# EAGLE design Main Board (EAGLE 6.0)
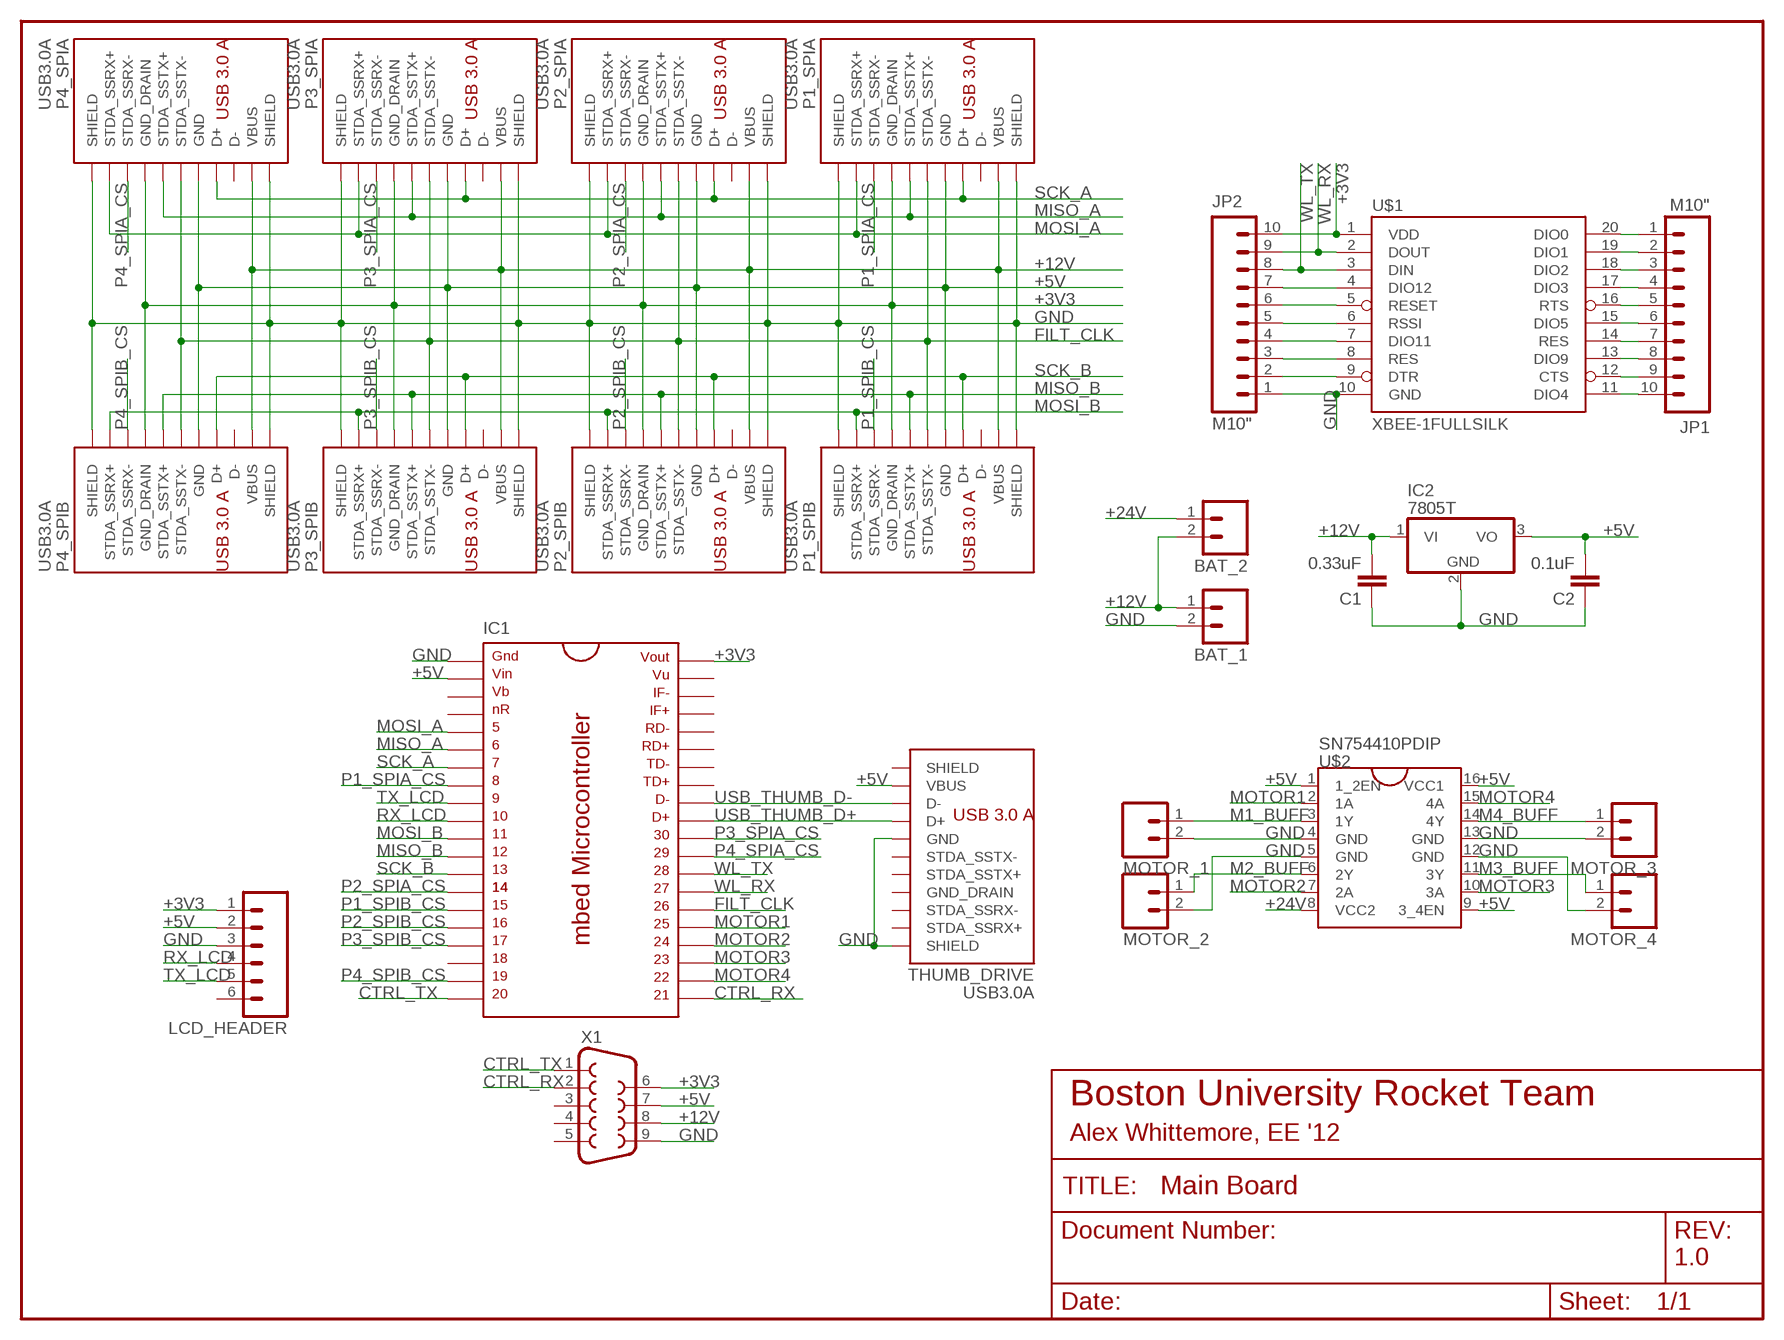
[diagram p0: schematic, sheet 1]

## Parts
BAT_1  M025MM  [SCREWTERMINAL-5MM-2]
BAT_2  M025MM  [SCREWTERMINAL-5MM-2]
C1  0.33uF  CAP0402-CAP  [0402-CAP]
C2  0.1uF  CAP0402-CAP  [0402-CAP]
IC1  MBED_MICROCONTROLLER  [DIL40_0.9]
IC2  7805T  [TO220H]
JP1  M10"  [1X10]
JP2  M10"  [1X10]
LCD_HEADER  M06LOCK  [1X06_LOCK]
MOTOR_1  M025MM  [SCREWTERMINAL-5MM-2]
MOTOR_2  M025MM  [SCREWTERMINAL-5MM-2]
MOTOR_3  M025MM  [SCREWTERMINAL-5MM-2]
MOTOR_4  M025MM  [SCREWTERMINAL-5MM-2]
P1_SPIA  USB3.0A  [AMPHENOLUSB3.0A]
P1_SPIB  USB3.0A  [AMPHENOLUSB3.0A]
P2_SPIA  USB3.0A  [AMPHENOLUSB3.0A]
P2_SPIB  USB3.0A  [AMPHENOLUSB3.0A]
P3_SPIA  USB3.0A  [AMPHENOLUSB3.0A]
P3_SPIB  USB3.0A  [AMPHENOLUSB3.0A]
P4_SPIA  USB3.0A  [AMPHENOLUSB3.0A]
P4_SPIB  USB3.0A  [AMPHENOLUSB3.0A]
THUMB_DRIVE  USB3.0A  [AMPHENOLUSB3.0A]
U$1  XBEE-1FULLSILK  [XBEE]
U$2  SN754410PDIP  [DIL16]
X1  DB9MALE  [DB9_MALE]

## Nets
+3V3: IC1.40 JP2.10 LCD_HEADER.1 P1_SPIA.7(GND_DRAIN) P1_SPIB.7(GND_DRAIN) P2_SPIA.7(GND_DRAIN) P2_SPIB.7(GND_DRAIN) P3_SPIA.7(GND_DRAIN) P3_SPIB.7(GND_DRAIN) P4_SPIA.7(GND_DRAIN) P4_SPIB.7(GND_DRAIN) U$1.1(VDD) X1.6
+5V: C2.2 IC1.2 IC2.3(VO) LCD_HEADER.2 P1_SPIA.4(GND) P1_SPIB.4(GND) P2_SPIA.4(GND) P2_SPIB.4(GND) P3_SPIA.4(GND) P3_SPIB.4(GND) P4_SPIA.4(GND) P4_SPIB.4(GND) THUMB_DRIVE.1(VBUS) U$2.1(1_2EN) U$2.9(3_4EN) U$2.16(VCC1) X1.7
+12V: BAT_1.1 BAT_2.2 C1.2 IC2.1(VI) P1_SPIA.1(VBUS) P1_SPIB.1(VBUS) P2_SPIA.1(VBUS) P2_SPIB.1(VBUS) P3_SPIA.1(VBUS) P3_SPIB.1(VBUS) P4_SPIA.1(VBUS) P4_SPIB.1(VBUS) X1.8
+24V: BAT_2.1 U$2.8(VCC2)
CTRL_RX: IC1.21 X1.2
CTRL_TX: IC1.20 X1.1
FILT_CLK: IC1.26 P1_SPIA.8(STDA_SSTX-) P1_SPIB.8(STDA_SSTX-) P2_SPIA.8(STDA_SSTX-) P2_SPIB.8(STDA_SSTX-) P3_SPIA.8(STDA_SSTX-) P3_SPIB.8(STDA_SSTX-) P4_SPIA.8(STDA_SSTX-) P4_SPIB.8(STDA_SSTX-)
GND: BAT_1.2 C1.1 C2.1 IC1.1 IC2.2(GND) JP2.1 LCD_HEADER.3 MOTOR_1.2 MOTOR_2.2 MOTOR_3.2 MOTOR_4.2 P1_SPIA.10@1(SHIELD) P1_SPIA.10@2(SHIELD) P1_SPIB.10@1(SHIELD) P1_SPIB.10@2(SHIELD) P2_SPIA.10@1(SHIELD) P2_SPIA.10@2(SHIELD) P2_SPIB.10@1(SHIELD) P2_SPIB.10@2(SHIELD) P3_SPIA.10@1(SHIELD) P3_SPIA.10@2(SHIELD) P3_SPIB.10@1(SHIELD) P3_SPIB.10@2(SHIELD) P4_SPIA.10@1(SHIELD) P4_SPIA.10@2(SHIELD) P4_SPIB.10@1(SHIELD) P4_SPIB.10@2(SHIELD) THUMB_DRIVE.4(GND) THUMB_DRIVE.10@2(SHIELD) U$1.10(GND) U$2.4(GND) U$2.5(GND) U$2.12(GND) U$2.13(GND) X1.9
M1_BUFF: MOTOR_1.1 U$2.3(1Y)
M2_BUFF: MOTOR_2.1 U$2.6(2Y)
M3_BUFF: MOTOR_4.1 U$2.11(3Y)
M4_BUFF: MOTOR_3.1 U$2.14(4Y)
MISO_A: IC1.6 P1_SPIA.9(STDA_SSTX+) P2_SPIA.9(STDA_SSTX+) P3_SPIA.9(STDA_SSTX+) P4_SPIA.9(STDA_SSTX+)
MISO_B: IC1.12 P1_SPIB.9(STDA_SSTX+) P2_SPIB.9(STDA_SSTX+) P3_SPIB.9(STDA_SSTX+) P4_SPIB.9(STDA_SSTX+)
MOSI_A: IC1.5 P1_SPIA.6(STDA_SSRX+) P2_SPIA.6(STDA_SSRX+) P3_SPIA.6(STDA_SSRX+) P4_SPIA.6(STDA_SSRX+)
MOSI_B: IC1.11 P1_SPIB.6(STDA_SSRX+) P2_SPIB.6(STDA_SSRX+) P3_SPIB.6(STDA_SSRX+) P4_SPIB.6(STDA_SSRX+)
MOTOR1: IC1.25 U$2.2(1A)
MOTOR2: IC1.24 U$2.7(2A)
MOTOR3: IC1.23 U$2.10(3A)
MOTOR4: IC1.22 U$2.15(4A)
N$3: JP2.7 U$1.4(DIO12)
N$4: JP2.6 U$1.5(RESET)
N$6: JP2.5 U$1.6(RSSI)
N$7: JP2.4 U$1.7(DIO11)
N$8: JP2.3 U$1.8(RES)
N$9: JP2.2 U$1.9(DTR)
N$10: JP1.1 U$1.20(DIO0)
N$11: JP1.2 U$1.19(DIO1)
N$12: JP1.3 U$1.18(DIO2)
N$13: JP1.4 U$1.17(DIO3)
N$14: JP1.5 U$1.16(RTS)
N$15: JP1.6 U$1.15(DIO5)
N$16: JP1.7 U$1.14(RES)
N$17: JP1.8 U$1.13(DIO9)
N$18: JP1.9 U$1.12(CTS)
N$19: JP1.10 U$1.11(DIO4)
P1_SPIA_CS: IC1.8 P1_SPIA.5(STDA_SSRX-)
P1_SPIB_CS: IC1.15 P1_SPIB.5(STDA_SSRX-)
P2_SPIA_CS: IC1.14 P2_SPIA.5(STDA_SSRX-)
P2_SPIB_CS: IC1.16 P2_SPIB.5(STDA_SSRX-)
P3_SPIA_CS: IC1.30 P3_SPIA.5(STDA_SSRX-)
P3_SPIB_CS: IC1.17 P3_SPIB.5(STDA_SSRX-)
P4_SPIA_CS: IC1.29 P4_SPIA.5(STDA_SSRX-)
P4_SPIB_CS: IC1.19 P4_SPIB.5(STDA_SSRX-)
RX_LCD: IC1.10 LCD_HEADER.4
SCK_A: IC1.7 P1_SPIA.3(D+) P2_SPIA.3(D+) P3_SPIA.3(D+) P4_SPIA.3(D+)
SCK_B: IC1.13 P1_SPIB.3(D+) P2_SPIB.3(D+) P3_SPIB.3(D+) P4_SPIB.3(D+)
TX_LCD: IC1.9 LCD_HEADER.5
USB_THUMB_D+: IC1.31 THUMB_DRIVE.3(D+)
USB_THUMB_D-: IC1.32 THUMB_DRIVE.2(D-)
WL_RX: IC1.27 JP2.9 U$1.2(DOUT)
WL_TX: IC1.28 JP2.8 U$1.3(DIN)
Unconnected: IC1.3 IC1.4 IC1.18 IC1.33 IC1.34 IC1.35 IC1.36 IC1.37 IC1.38 IC1.39 LCD_HEADER.6 P1_SPIA.2(D-) P1_SPIB.2(D-) P2_SPIA.2(D-) P2_SPIB.2(D-) P3_SPIA.2(D-) P3_SPIB.2(D-) P4_SPIA.2(D-) P4_SPIB.2(D-) THUMB_DRIVE.5(STDA_SSRX-) THUMB_DRIVE.6(STDA_SSRX+) THUMB_DRIVE.7(GND_DRAIN) THUMB_DRIVE.8(STDA_SSTX-) THUMB_DRIVE.9(STDA_SSTX+) THUMB_DRIVE.10@1(SHIELD) X1.3 X1.4 X1.5

## Notes on the sheet
- Boston University Rocket Team
- Alex Whittemore, EE '12
- 1.0

## Library data of the parts
BAT_1 BAT_2 MOTOR_1-MOTOR_4 = SparkFun:M02: Header 2 Standard 2-pin 0.1" header. Use with straight break away headers (SKU : PRT-00116), right angle break away headers (PRT-00553), swiss pins (PRT-00743), machine pins (PRT-00117), and female headers (PRT-00115). Molex polarized connector foot print use with SKU : PRT-08233 with associated crimp pins and housings.
C1 C2 = SparkFun:CAP: Capacitor Standard 0603 ceramic capacitor, and 0.1" leaded capacitor.
IC1 = mbed-microcontroller:MBED_MICROCONTROLLER: mbed Microcontroller, DIP40, 0.9"
IC2 = linear:78*: Positive VOLTAGE REGULATOR Source: http://cache.national.com/ds/LM/LM78L05.pdf http://www.fairchildsemi.com/ds/LM/LM7805.pdf
JP1 JP2 = SparkFun:M10: Header 10 Standard 10-pin 0.1" header. Use with straight break away headers (SKU : PRT-00116), right angle break away headers (PRT-00553), swiss pins (PRT-00743), machine pins (PRT-00117), and female headers (PRT-00115).
LCD_HEADER = SparkFun:M06: Header 6 Standard 6-pin 0.1" header. Use with straight break away headers (SKU : PRT-00116), right angle break away headers (PRT-00553), swiss pins (PRT-00743), machine pins (PRT-00117), and female headers (PRT-00115). Molex polarized connector foot print use with SKU : PRT-08094 with associated crimp pins and housings. NOTES ON THE VARIANTS LOCK and LOCK_LONGPADS... This footprint was designed to help hold the alignment of a through-hole component (i.e. 6-pin header) while soldering it into place. You may notice that each hole has been shifted either up or down by 0.005 of an inch from it's more standard position (which is a perfectly straight line). This slight alteration caused the pins (the squares in the middle) to touch the edges of the holes. Because they are alternating, it causes a "brace" to hold the component in place. 0.005 has proven to be the perfect amount of "off-center" position when using our standard breakaway headers. Although looks a little odd when you look at the bare footprint, once you have a header in there, the alteration is very hard to notice. Also, if you push a header all the way into place, it is covered up entirely on the bottom side. This idea of altering the position of holes to aid alignment will be further integrated into the Sparkfun Library for other footprints. It can help hold any component with 3 or more connection pins.
P1_SPIA P1_SPIB P2_SPIA P2_SPIB P3_SPIA P3_SPIB P4_SPIA P4_SPIB THUMB_DRIVE = AlexsParts:USB3.0A: Usb3.0A Amphenol USB 3.0 A jack
U$1 = SparkFun:XBEE-1
U$2 = AlexsParts:SN754410
X1 = SparkFun:DB9: DB9 Connector Standard DB9 (D-Sub 9) serial connector. Can be used for CAN bus as well as RS485 and RS232. Footprint production proven. Spark Fun Electronics SKU : PRT-00429

## Board
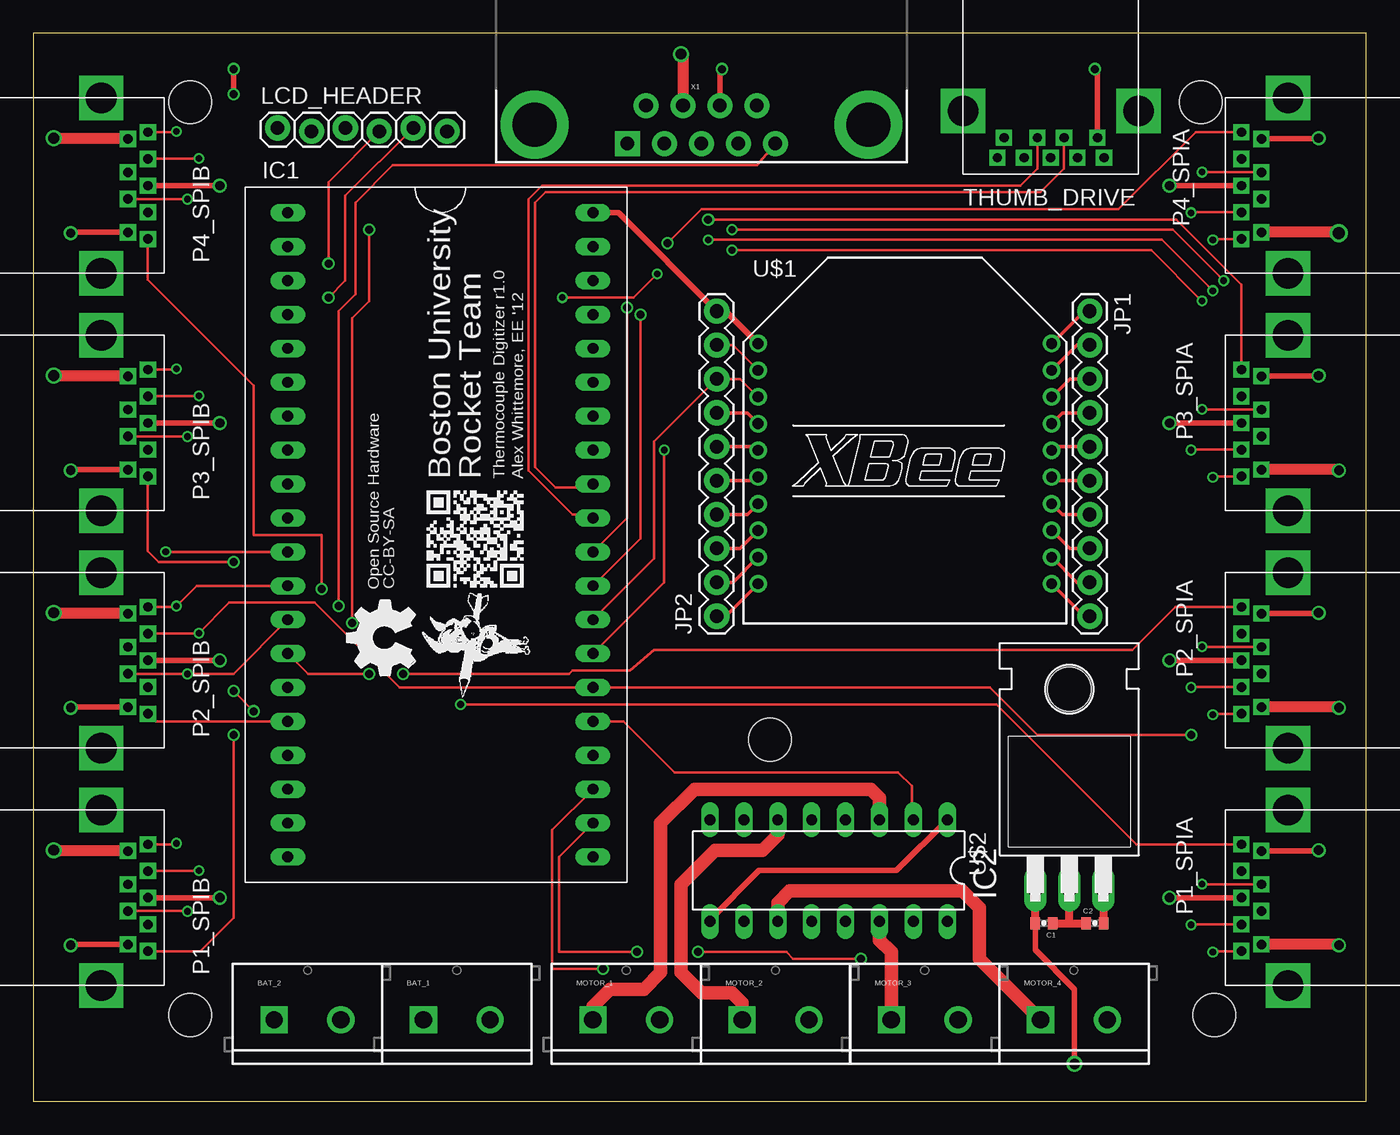
[diagram p1: board, top side]
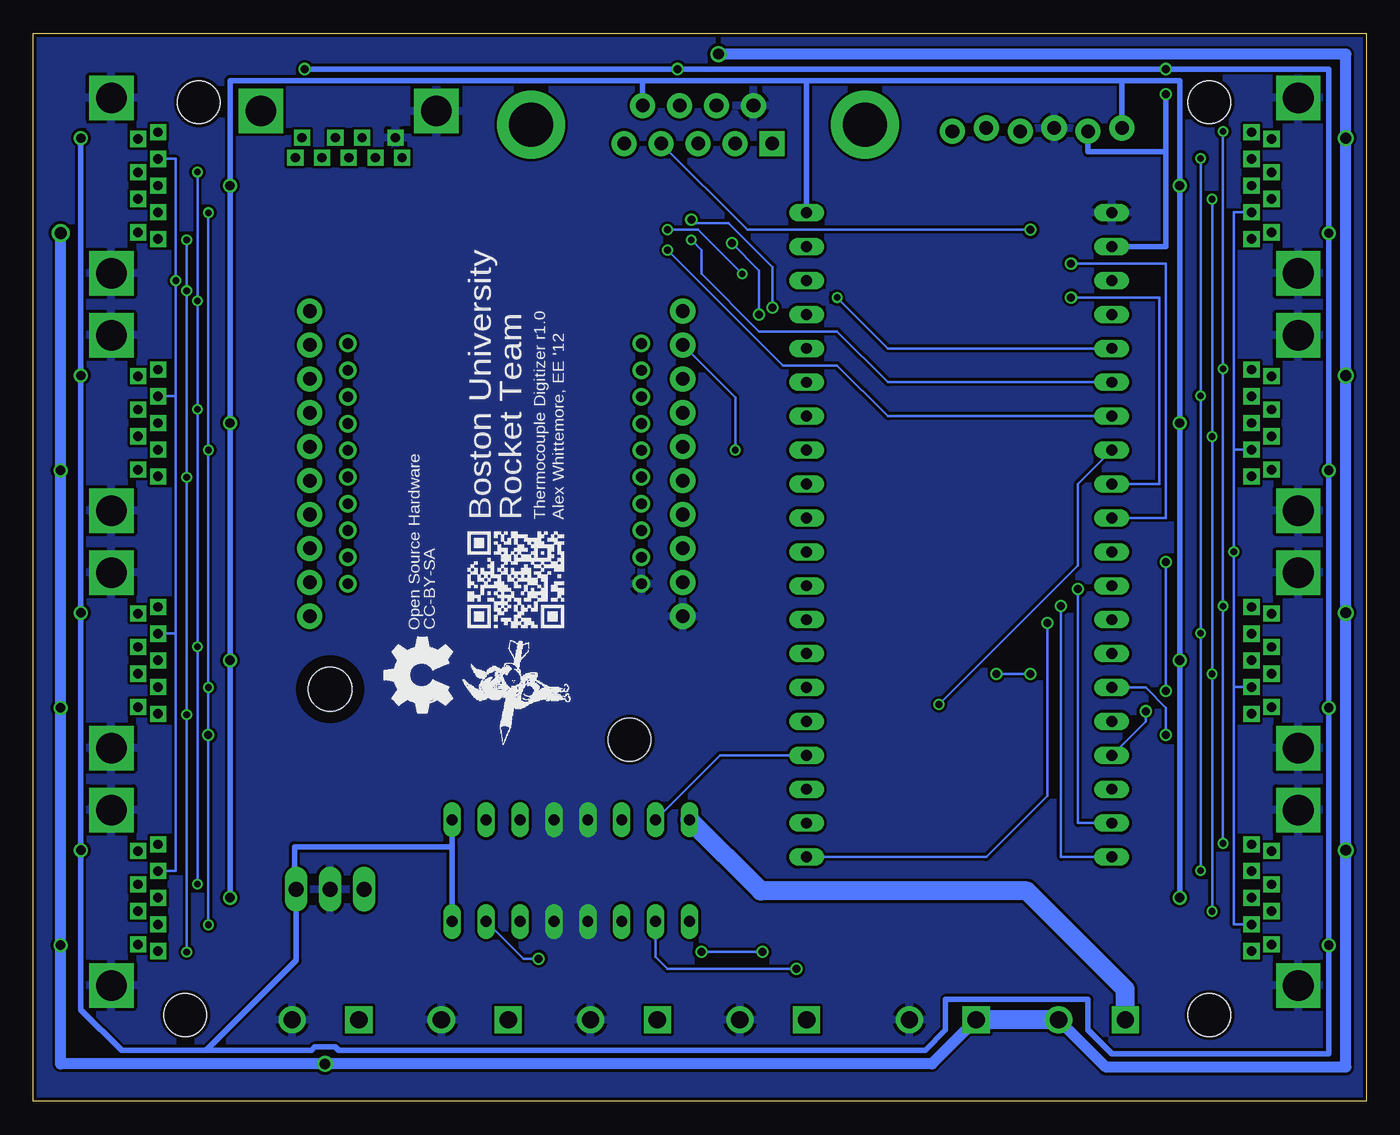
[diagram p2: board, bottom side, seen from below]

Size 99.82 x 79.98 mm. Coordinates in mm from the lower left corner, seen from the top.
Outline: 0,0 99.82,0 99.82,79.98 0,79.98 0,0
Copper layers (1*16): Top 0.035mm / dielectric 1.5mm / Bottom 0.035mm
Design rules: minimum track width 6mil, minimum drill 12mil, track to track 8mil, track to pad 8mil, pad to pad 8mil, via to via 8mil, smd to smd 0mil, copper to edge 10mil, drill to drill 10mil, minimum pad ring 10mil, minimum via ring 6mil, stop-mask expansion 2mil, vias tented up to drill 100mil, thermal gap 10mil
Holes 3.2 mm at 11.73,6.45 55.17,27.08 88.44,6.45 11.73,74.83 87.43,74.83

### Footprints (pad centres in the part's own frame; a part is rotated, then mirrored left to right if it is on the bottom)
SCREWTERMINAL-5MM-2 = drill 1.3 pad 2.032 square: 1 0,0 | drill 1.3 pad 2.032: 2 5,0
0402-CAP = smd 0.7 x 0.9: 1 -0.65,0; 2 0.65,0
DIL40_0.9 = drill 0.813 long: 1 -22.86,-11.43; 2 -20.32,-11.43; 3 -17.78,-11.43; 4 -15.24,-11.43; 5 -12.7,-11.43; 6 -10.16,-11.43; 7 -7.62,-11.43; 8 -5.08,-11.43; 9 -2.54,-11.43; 10 0,-11.43; 11 2.54,-11.43; 12 5.08,-11.43; 13 7.62,-11.43; 14 10.16,-11.43; 15 12.7,-11.43; 16 15.24,-11.43; 17 17.78,-11.43; 18 20.32,-11.43; 19 22.86,-11.43; 20 25.4,-11.43; 21 25.4,11.43; 22 22.86,11.43; 23 20.32,11.43; 24 17.78,11.43; 25 15.24,11.43; 26 12.7,11.43; 27 10.16,11.43; 28 7.62,11.43; 29 5.08,11.43; 30 2.54,11.43; 31 0,11.43; 32 -2.54,11.43; 33 -5.08,11.43; 34 -7.62,11.43; 35 -10.16,11.43; 36 -12.7,11.43; 37 -15.24,11.43; 38 -17.78,11.43; 39 -20.32,11.43; 40 -22.86,11.43
TO220H = drill 1.118 long: 1 -2.54,-10.16; 2 0,-10.16; 3 2.54,-10.16 | hole 3.302: 0,4.826
1X10 = drill 1.016 pad 1.88: 1 0,0; 2 2.54,0; 3 5.08,0; 4 7.62,0; 5 10.16,0; 6 12.7,0; 7 15.24,0; 8 17.78,0; 9 20.32,0; 10 22.86,0
1X06_LOCK = drill 1.016 pad 1.88: 1 0,0; 2 2.54,-0.254; 3 5.08,0; 4 7.62,-0.254; 5 10.16,0; 6 12.7,-0.254
AMPHENOLUSB3.0A = drill 0.7 square: 1 -3.5,2; 2 -1,2; 3 1,2; 4 3.5,2; 5 4,3.5; 6 2,3.5; 7 0,3.5; 8 -2,3.5; 9 -4,3.5 | drill 2.3 square: 10@1 -6.57,0; 10@2 6.57,0
XBEE = drill 0.8 pad 1.27: 1 -11,9; 2 -11,7; 3 -11,5; 4 -11,3; 5 -11,1; 6 -11,-1; 7 -11,-3; 8 -11,-5; 9 -11,-7; 10 -11,-9; 11 11,-9; 12 11,-7; 13 11,-5; 14 11,-3; 15 11,-1; 16 11,1; 17 11,3; 18 11,5; 19 11,7; 20 11,9
DIL16 = drill 0.813 long: 1 -8.89,-3.81; 2 -6.35,-3.81; 3 -3.81,-3.81; 4 -1.27,-3.81; 5 1.27,-3.81; 6 3.81,-3.81; 7 6.35,-3.81; 8 8.89,-3.81; 9 8.89,3.81; 10 6.35,3.81; 11 3.81,3.81; 12 1.27,3.81; 13 -1.27,3.81; 14 -3.81,3.81; 15 -6.35,3.81; 16 -8.89,3.81
DB9_MALE = drill 1.016 pad 1.88: 1 5.54,-1.42; 2 2.77,-1.42; 3 0,-1.42; 4 -2.77,-1.42; 6 4.15,1.42; 7 1.38,1.42; 8 -1.38,1.42; 9 -4.15,1.42 | drill 1.016 pad 1.88 square: 5 -5.54,-1.42 | drill 3.302 pad 5.08: G1 -12.5,0; G2 12.5,0

### Placement (x,y rotation side)
BAT_1  29.21,6.1 0 top
BAT_2  18.03,6.1 0 top
C1  75.69,13.34 180 top
C2  79.5,13.34 0 top
IC1  30.48,43.69 270 top
IC2  77.6,26.04 0 top
JP1  79.12,59.18 270 top
JP2  51.18,36.32 90 top
LCD_HEADER  18.29,72.9 0 top
MOTOR_1  41.91,6.1 0 top
MOTOR_2  53.09,6.1 0 top
MOTOR_3  64.26,6.1 0 top
MOTOR_4  75.44,6.1 0 top
P1_SPIA  93.98,15.24 90 top
P1_SPIB  5.08,15.24 270 top
P2_SPIA  93.98,33.02 90 top
P2_SPIB  5.08,33.02 270 top
P3_SPIA  93.98,50.8 90 top
P3_SPIB  5.08,50.8 270 top
P4_SPIA  93.98,68.58 90 top
P4_SPIB  5.08,68.58 270 top
THUMB_DRIVE  76.2,74.17 180 top
U$1  65.28,47.75 0 top
U$2  59.56,17.27 180 top
U$3  [OSHW_FILLX200_NOTEXT]  28.57,31.88 90 top
U$4  [OSHW_FILLX200_NOTEXT]  68.45,29.08 90 bottom
X1  50.04,73.15 0 top

### Tracks (layer width: path | path; a pad name or v marks a point on that pad's centre or on a via)
+3V3  (via drill 0.7)
  Top 0.406: v85.09,68.58 P4_SPIA.7 | v85.09,50.8 P3_SPIA.7 | v85.09,33.02 P2_SPIA.7 | v85.09,15.24 P1_SPIA.7 | v13.97,68.58 P4_SPIB.7 | v13.97,50.8 P3_SPIB.7 | v13.97,33.02 P2_SPIB.7 | P1_SPIB.7 v13.97,15.24 | IC1.40 43.81,66.55 JP2.10 51.85,59.18 U$1.1
  Bottom 0.406: v85.09,15.24 v85.09,33.02 v85.09,50.8 v85.09,68.58 85.09,76.45 54.1,76.45 | v13.97,15.24 v13.97,33.02 v13.97,50.8 v13.97,68.58 13.97,76.45 18.29,76.45 | 18.29,76.45 41.91,76.45 | 41.91,76.45 54.1,76.45 | 41.91,76.45 IC1.40 | X1.6 54.19,76.37 54.1,76.45 | 18.29,76.45 LCD_HEADER.1
+5V  (via drill 0.6, 0.7)
  Top 0.406: P1_SPIA.4 96.27,18.74 v96.27,18.8 | P2_SPIA.4 96.27,36.52 v96.27,36.58 | P3_SPIA.4 96.27,54.3 v96.27,54.36 | P4_SPIA.4 96.27,72.08 v96.27,72.14 | P1_SPIB.4 2.79,11.74 v2.79,11.68 | P2_SPIB.4 2.79,29.52 v2.79,29.46 | P3_SPIB.4 2.79,47.3 v2.79,47.24 | P4_SPIB.4 2.79,65.08 v2.79,65.02 | v14.99,77.32 v14.99,75.44 | U$2.9 50.67,13.59 54.36,17.27 64.64,17.27 U$2.1 | X1.7 51.42,77.17 v51.56,77.32 | THUMB_DRIVE.1 79.7,77.12 v79.5,77.32
  Top 0.61: IC2.3 80.14,13.34 C2.2
  Bottom 0.406: v96.27,72.14 v96.27,54.36 v96.27,36.58 v96.27,18.8 96.27,6.86 93.22,3.81 86.87,3.81 | 86.87,3.81 80.14,10.54 IC2.3 80.26,15.88 80.26,19.05 68.45,19.05 U$2.16 U$2.1 | IC1.2 14.99,64.01 14.99,71.12 | v14.99,75.44 14.99,71.12 | LCD_HEADER.2 20.83,71.12 14.99,71.12 | v79.5,77.32 v51.56,77.32 v14.99,77.32 2.79,77.32 v2.79,65.02 v2.79,47.24 v2.79,29.46 v2.79,11.68 2.79,3.56 19.05,3.56 20.83,5.33 20.83,7.62 31.5,7.62 31.5,5.33 33.02,3.81 76.96,3.81 77.22,4.06 78.74,4.06 78.99,3.81 86.87,3.81
+12V  (via drill 0.7, 0.8, 0.9)
  Top 0.406: v97.79,65.02 97.28,65.08 | C1.2 75.04,11.32 77.98,8.38 v77.98,2.79
  Top 0.61: IC2.1 75.04,15.88 C1.2
  Top 0.813: 97.28,65.08 P4_SPIA.1 | P2_SPIA.1 97.79,29.52 v97.79,29.46 | P1_SPIA.1 97.79,11.74 v97.79,11.68 | P3_SPIA.1 97.79,47.3 v97.79,47.24 | v48.51,78.44 48.66,78.44 X1.8 | v1.52,18.8 7.08,18.8 P1_SPIB.1 | v1.52,36.58 7.08,36.58 P2_SPIB.1 | v1.52,54.36 7.08,54.36 P3_SPIB.1 | v1.52,72.14 7.08,72.14 P4_SPIB.1
  Bottom 0.813: v97.79,65.02 v97.79,47.24 v97.79,29.46 v97.79,11.68 97.79,2.79 v77.98,2.79 32.51,2.79 BAT_1.1 | BAT_2.2 19.48,2.54 1.52,2.54 v1.52,18.8 v1.52,36.58 v1.52,54.36 v1.52,72.14 1.52,78.44 v48.51,78.44
  Bottom 1.422: BAT_2.2 BAT_1.1
+24V
  Bottom 1.422: BAT_2.1 18.03,8.38 25.4,15.75 45.34,15.75 U$2.8
CTRL_RX  (via drill 0.6)
  Top 0.203: v25.15,65.28 25.15,59.94 23.88,58.67 v23.88,35.81
  Bottom 0.203: X1.2 46.35,65.28 v25.15,65.28 | IC1.21 28.45,18.29 23.88,22.86 v23.88,35.81
CTRL_TX  (via drill 0.6)
  Top 0.203: X1.1 54.2,70.1 26.92,70.1 24.13,67.31 24.13,60.45 22.86,59.18 v22.86,37.08
  Bottom 0.203: v22.86,37.08 22.86,18.29 IC1.20
FILT_CLK  (via drill 0.5, 0.6)
  Top 0.203: P4_SPIA.8 86.72,66.58 v86.72,66.55 | P3_SPIA.8 86.72,48.8 v86.72,48.77 | P2_SPIA.8 86.72,31.02 v86.72,30.99 | P1_SPIA.8 86.72,13.24 v86.72,13.21 | P4_SPIB.8 12.39,70.58 v12.39,70.61 | P3_SPIB.8 12.39,52.8 v12.39,52.83 | P2_SPIB.8 12.39,35.02 v12.39,35.05 14.68,37.34 21.08,37.34 27.43,30.99 IC1.26 71.63,30.99 75.18,27.43 v86.72,27.43 | P1_SPIB.8 12.39,17.24 v12.39,17.27
  Bottom 0.203: v86.72,13.21 v86.72,27.43 v86.72,30.99 v86.72,48.77 v86.72,66.55 | v12.39,70.61 v12.39,52.83 v12.39,35.05 v12.39,17.27
GND
  Top 0.254: JP2.1 51.85,36.32 U$1.10
  Top 0.61: 77.6,13.34 IC2.2 | C1.1 77.6,13.34 | 77.6,13.34 C2.1
  pour Bottom: 0,0 0,80.01 99.69,80.01 99.69,0
  pour Bottom (no thermals): 57.4,22.86 61.72,22.86 61.72,11.94 57.4,11.94
M1_BUFF
  Top 1.016: U$2.3 63.37,22.73 62.74,23.37 49.53,23.37 46.99,20.83 46.99,9.65 45.72,8.38 43.18,8.38 41.91,7.11 MOTOR_1.1
M2_BUFF
  Top 1.016: U$2.6 55.75,19.94 54.61,18.8 51.05,18.8 48.51,16.26 48.51,9.65 50.04,8.13 52.32,8.13 53.09,7.37 MOTOR_2.1
M3_BUFF
  Top 1.016: U$2.11 55.75,14.86 56.64,15.75 69.6,15.75 70.87,14.48 70.87,10.67 MOTOR_4.1
M4_BUFF
  Top 1.016: U$2.14 63.37,12.06 64.26,11.18 MOTOR_3.1
MISO_A  (via drill 0.5)
  Top 0.203: P1_SPIA.9 88.34,11.24 v88.34,11.18 | P2_SPIA.9 88.34,29.02 v88.34,28.96 | P3_SPIA.9 88.34,46.8 v88.34,46.74 | P4_SPIA.9 88.34,64.58 v88.34,64.52 | v50.55,64.52 84.53,64.52 v88.34,60.71
  Bottom 0.203: v88.34,64.52 v88.34,60.71 v88.34,46.74 v88.34,28.96 v88.34,11.18 | IC1.6 35.81,53.85 39.62,57.66 45.47,57.66 49.78,61.98 49.78,63.75 v50.55,64.52
MISO_B  (via drill 0.5)
  Top 0.203: P4_SPIB.9 10.72,72.58 v10.72,72.64 | P3_SPIB.9 10.72,54.8 v10.72,54.86 | P2_SPIB.9 10.72,37.02 v10.72,37.08 12.24,38.61 IC1.12 | P1_SPIB.9 10.72,19.24 v10.72,19.3
  Bottom 0.203: v10.72,72.64 v10.72,54.86 v10.72,37.08 v10.72,19.3
MOSI_A  (via drill 0.5)
  Top 0.203: v39.62,60.2 44.96,60.2 v46.74,61.98 | v52.32,65.28 85.34,65.28 v89.15,61.47
  Bottom 0.203: P1_SPIA.6 89.15,17.24 89.15,35.02 | 89.15,35.02 P2_SPIA.6 | 89.15,52.8 89.15,35.02 | 89.15,52.8 P3_SPIA.6 | P4_SPIA.6 89.15,70.58 v89.15,61.47 89.15,52.8 | IC1.5 35.81,56.39 v39.62,60.2 | v46.74,61.98 50.04,65.28 v52.32,65.28
MOSI_B  (via drill 0.5)
  Top 0.203: v9.91,41.15 IC1.11
  Bottom 0.203: P1_SPIB.6 9.91,13.24 9.91,31.02 | 9.91,31.02 P2_SPIB.6 | 9.91,48.8 P3_SPIB.6 | 9.91,31.02 v9.91,41.15 9.91,41.4 9.91,48.8 | P4_SPIB.6 9.91,66.58 9.91,48.8
MOTOR1
  Top 0.203: IC1.25 44.2,28.45 48.01,24.64 64.77,24.64 65.79,23.62 65.79,21.21 U$2.2
MOTOR2
  Bottom 0.203: IC1.24 48.39,25.91 U$2.7
MOTOR3  (via drill 0.6)
  Top 0.203: IC1.23 38.86,20.32 38.86,9.91 v42.67,9.91
  Bottom 0.203: U$2.10 53.21,10.79 52.32,9.91 v42.67,9.91
MOTOR4  (via drill 0.6)
  Top 0.203: IC1.22 39.37,18.29 39.37,11.18 v45.21,11.18 | v49.78,11.18 56.39,11.18 56.9,10.67 v61.98,10.67
  Bottom 0.203: v45.21,11.18 v49.78,11.18 | v61.98,10.67 63.12,10.67 U$2.15
N$3
  Top 0.254: JP2.7 53.47,51.56 U$1.4
N$4
  Top 0.254: JP2.6 54.01,49.02 U$1.5
N$6
  Top 0.254: JP2.5 54.01,46.48 U$1.6
N$7
  Top 0.254: JP2.4 53.47,43.94 U$1.7
N$8
  Top 0.254: JP2.3 52.93,41.4 U$1.8
N$9
  Top 0.254: JP2.2 52.39,38.86 U$1.9
N$10
  Top 0.254: JP1.1 78.71,59.18 U$1.20
N$11
  Top 0.254: JP1.2 78.17,56.64 U$1.19
N$12
  Top 0.254: JP1.3 77.63,54.1 U$1.18
N$13
  Top 0.254: JP1.4 77.09,51.56 U$1.17
N$14
  Top 0.254: JP1.5 76.55,49.02 U$1.16
N$15
  Top 0.254: JP1.6 76.55,46.48 U$1.15
N$16
  Top 0.254: JP1.7 77.09,43.94 U$1.14
N$17
  Top 0.254: JP1.8 77.63,41.4 U$1.13
N$18
  Top 0.254: JP1.9 78.17,38.86 U$1.12
N$19
  Top 0.254: JP1.10 78.71,36.32 U$1.11
P1_SPIA_CS  (via drill 0.5)
  Top 0.203: P1_SPIA.5 82.61,19.24 72.14,29.72 v32,29.72
  Bottom 0.203: v32,29.72 21.59,40.13 21.59,46.23 IC1.8
P1_SPIB_CS  (via drill 0.6)
  Top 0.203: P1_SPIB.5 12.51,11.24 14.99,13.72 v14.99,27.43
  Bottom 0.203: v14.99,27.43 14.99,29.46 16.51,30.99 IC1.15
P2_SPIA_CS  (via drill 0.6)
  Top 0.203: P2_SPIA.5 85.53,37.02 82.3,33.78 46.48,33.78 44.7,32.26 40.39,32.26 40.13,32 v27.69,32 | v25.15,32 20.57,32 IC1.14
  Bottom 0.203: v25.15,32 v27.69,32
P2_SPIB_CS
  Top 0.203: IC1.16 9.15,28.45 P2_SPIB.5
P3_SPIA_CS  (via drill 0.6)
  Top 0.203: IC1.30 44.45,43.69 v44.45,59.44 | P3_SPIA.5 90.48,61.16 85.6,66.04 v50.55,66.04
  Bottom 0.203: v44.45,59.44 44.45,62.48 47.75,65.79 50.29,65.79 v50.55,66.04
P3_SPIB_CS  (via drill 0.6)
  Top 0.203: v16.51,29.21 v14.99,30.73 | P3_SPIB.5 8.58,41.2 9.4,40.39 v14.99,40.39
  Bottom 0.203: v14.99,30.73 v14.99,40.39 | v16.51,29.21 16.51,28.45 IC1.17
P4_SPIA_CS  (via drill 0.6)
  Top 0.203: P4_SPIA.5 87.06,72.58 81.28,66.8 50.04,66.8 v47.5,64.26 | v45.47,58.93 45.47,42.16 IC1.29
  Bottom 0.203: v47.5,64.26 45.47,62.23 v45.47,58.93
P4_SPIB_CS  (via drill 0.6)
  Top 0.203: P4_SPIB.5 8.58,61.52 16.51,53.59 16.51,42.42 21.59,42.42 v21.59,38.35
  Bottom 0.203: v21.59,38.35 21.59,20.83 IC1.19
RX_LCD  (via drill 0.6)
  Top 0.203: v22.1,62.74 22.1,68.83 LCD_HEADER.4
  Bottom 0.203: IC1.10 14.99,43.69 14.99,62.74 v22.1,62.74
SCK_A  (via drill 0.5)
  Top 0.203: P4_SPIA.3 87.53,69.58 v87.53,69.6 | P3_SPIA.3 87.53,51.8 v87.53,51.82 | P2_SPIA.3 87.53,34.02 v87.53,34.04 | P1_SPIA.3 87.53,16.24 v87.53,16.26 | v52.32,63.75 83.72,63.75 v87.53,59.94
  Bottom 0.203: v87.53,69.6 v87.53,59.94 v87.53,51.82 v87.53,34.04 v87.53,16.26 | IC1.7 35.81,51.31 39.62,55.12 43.69,55.12 v52.32,63.75
SCK_B  (via drill 0.5)
  Top 0.203: P4_SPIB.3 11.53,67.58 v11.53,67.56 | P3_SPIB.3 11.53,49.8 v11.53,49.78 | P2_SPIB.3 11.53,32.02 v11.53,32 14.99,32 IC1.13 | P1_SPIB.3 11.53,14.24 v11.53,14.22
  Bottom 0.203: v11.53,14.22 v11.53,32 v11.53,49.78 v11.53,67.56
TX_LCD  (via drill 0.6)
  Top 0.203: v22.1,60.2 23.37,61.47 23.37,67.82 LCD_HEADER.5
  Bottom 0.203: IC1.9 15.49,46.23 15.49,60.2 v22.1,60.2
USB_THUMB_D+
  Top 0.203: THUMB_DRIVE.3 75.2,69.87 73.91,68.58 38.1,68.58 37.08,67.56 37.08,47.24 40.39,43.94 41.66,43.94 IC1.31
USB_THUMB_D-
  Top 0.203: THUMB_DRIVE.2 77.2,69.83 75.44,68.07 38.35,68.07 37.59,67.31 37.59,47.5 39.12,45.97 41.66,45.97 IC1.32
WL_RX  (via drill 0.5)
  Top 0.203: IC1.27 47.24,38.86 v47.24,48.77 | JP2.9 52.39,56.64 U$1.2
  Bottom 0.203: v47.24,48.77 47.24,52.7 JP2.9
WL_TX
  Top 0.203: IC1.28 46.48,40.64 46.48,49.4 JP2.8 52.93,54.1 U$1.3

### Text on the board
tValues: Bat2 + | - | Bat1 + | - (GND) | M1 | GND | M2 | GND | M3 | GND | M4 | GND
_tsilk: Boston University | Rocket Team | Thermocouple Digitizer r1.0 | Alex Whittemore, EE '12 | Open Source Hardware | CC-BY-SA
_bsilk: Alex Whittemore, EE '12 | Thermocouple Digitizer r1.0 | Rocket Team | Boston University | CC-BY-SA | Open Source Hardware